# Altium project 324 Electrode Wafer.PrjPcb
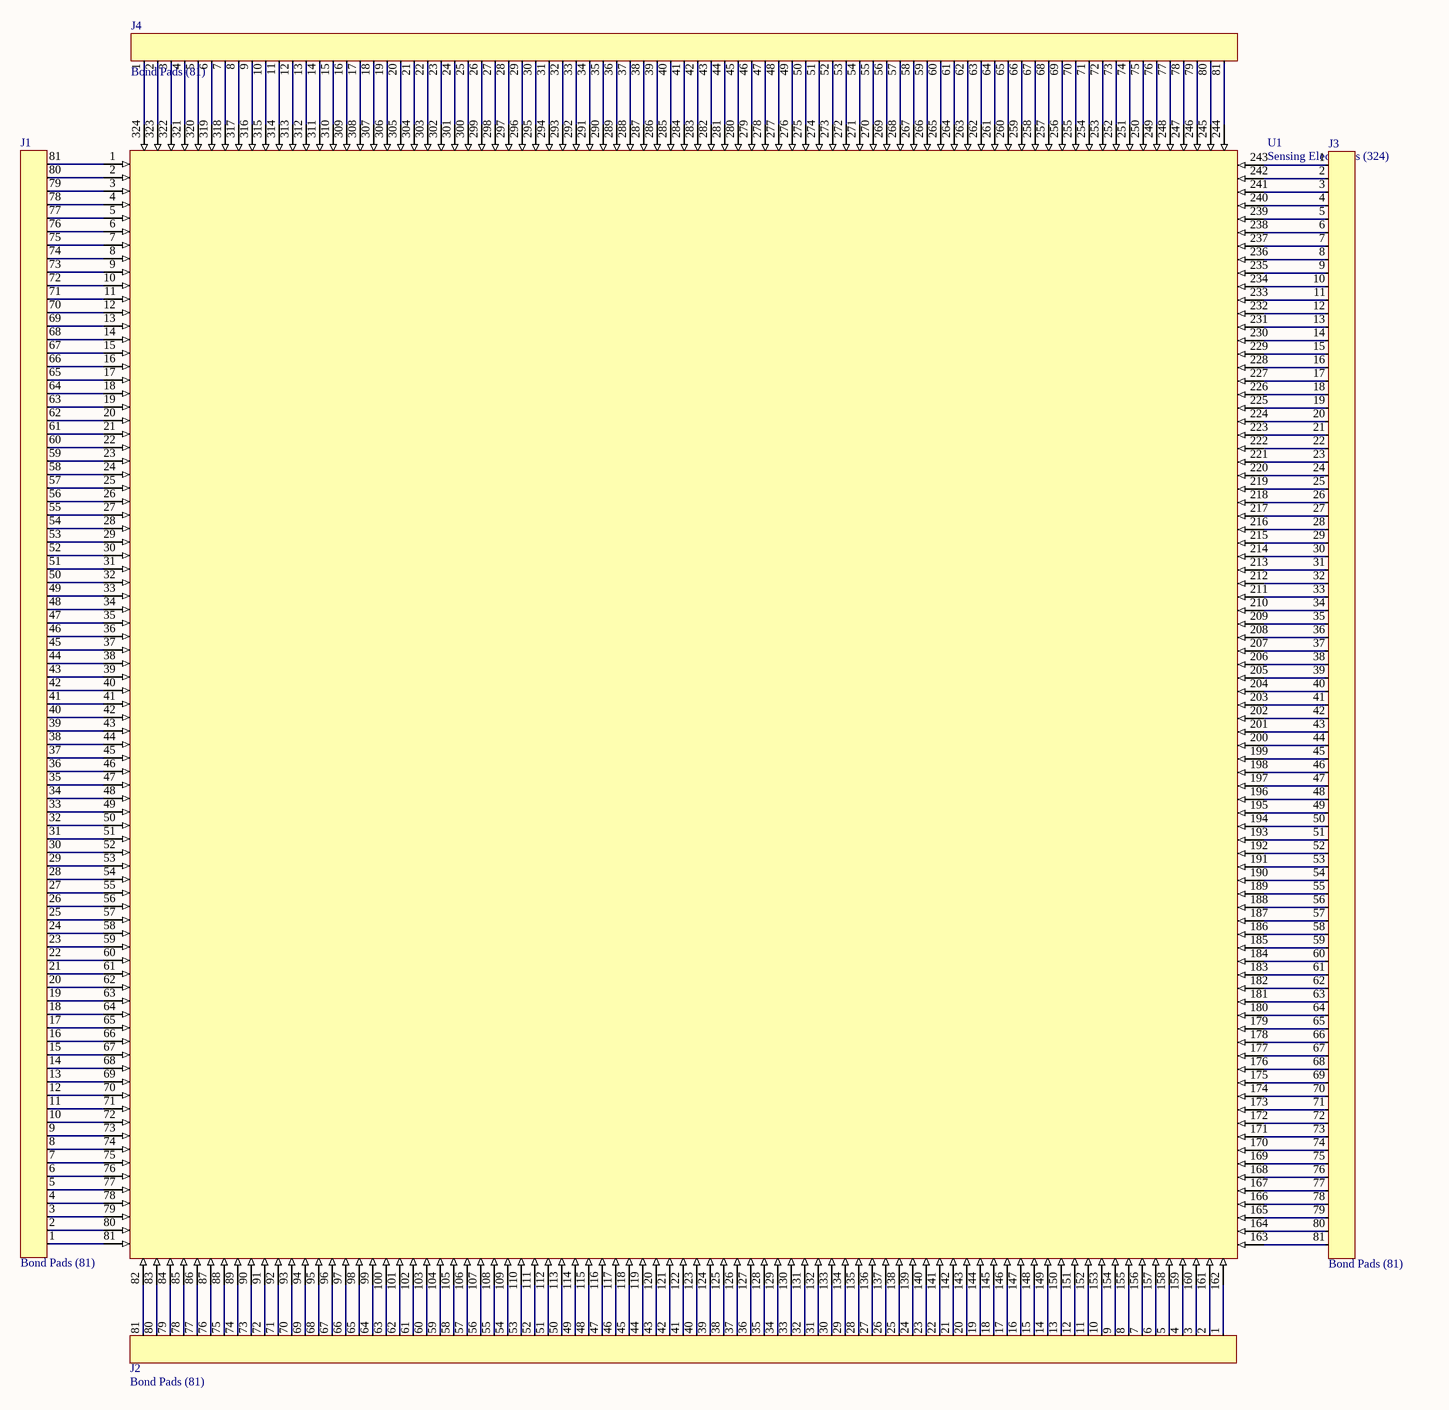
[diagram p0: 324 Electrode Wafer Schematic.SchDoc]
1 sheet, 5 parts. Net scope: global (net labels, ports and power ports of the same name join across sheets).
Board file: 324 Electrode Wafer PCB.PcbDoc

## Sheet 324 Electrode Wafer Schematic.SchDoc
size E; SheetNumber: 1; SheetTotal: 1

### Parts
J1  Bond Pads (81)  [Bond Pads (81)]
J2  Bond Pads (81)  [Bond Pads (81)]
J3  Bond Pads (81)  [Bond Pads (81)]
J4  Bond Pads (81)  [Bond Pads (81)]
U1  Sensing Electrodes (324)  [Sensing Area (324)]

### Nets
NetJ1_1: J1.1 U1.81
NetJ1_2: J1.2 U1.80
NetJ1_3: J1.3 U1.79
NetJ1_4: J1.4 U1.78
NetJ1_5: J1.5 U1.77
NetJ1_6: J1.6 U1.76
NetJ1_7: J1.7 U1.75
NetJ1_8: J1.8 U1.74
NetJ1_9: J1.9 U1.73
NetJ1_10: J1.10 U1.72
NetJ1_11: J1.11 U1.71
NetJ1_12: J1.12 U1.70
NetJ1_13: J1.13 U1.69
NetJ1_14: J1.14 U1.68
NetJ1_15: J1.15 U1.67
NetJ1_16: J1.16 U1.66
NetJ1_17: J1.17 U1.65
NetJ1_18: J1.18 U1.64
NetJ1_19: J1.19 U1.63
NetJ1_20: J1.20 U1.62
NetJ1_21: J1.21 U1.61
NetJ1_22: J1.22 U1.60
NetJ1_23: J1.23 U1.59
NetJ1_24: J1.24 U1.58
NetJ1_25: J1.25 U1.57
NetJ1_26: J1.26 U1.56
NetJ1_27: J1.27 U1.55
NetJ1_28: J1.28 U1.54
NetJ1_29: J1.29 U1.53
NetJ1_30: J1.30 U1.52
NetJ1_31: J1.31 U1.51
NetJ1_32: J1.32 U1.50
NetJ1_33: J1.33 U1.49
NetJ1_34: J1.34 U1.48
NetJ1_35: J1.35 U1.47
NetJ1_36: J1.36 U1.46
NetJ1_37: J1.37 U1.45
NetJ1_38: J1.38 U1.44
NetJ1_39: J1.39 U1.43
NetJ1_40: J1.40 U1.42
NetJ1_41: J1.41 U1.41
NetJ1_42: J1.42 U1.40
NetJ1_43: J1.43 U1.39
NetJ1_44: J1.44 U1.38
NetJ1_45: J1.45 U1.37
NetJ1_46: J1.46 U1.36
NetJ1_47: J1.47 U1.35
NetJ1_48: J1.48 U1.34
NetJ1_49: J1.49 U1.33
NetJ1_50: J1.50 U1.32
NetJ1_51: J1.51 U1.31
NetJ1_52: J1.52 U1.30
NetJ1_53: J1.53 U1.29
NetJ1_54: J1.54 U1.28
NetJ1_55: J1.55 U1.27
NetJ1_56: J1.56 U1.26
NetJ1_57: J1.57 U1.25
NetJ1_58: J1.58 U1.24
NetJ1_59: J1.59 U1.23
NetJ1_60: J1.60 U1.22
NetJ1_61: J1.61 U1.21
NetJ1_62: J1.62 U1.20
NetJ1_63: J1.63 U1.19
NetJ1_64: J1.64 U1.18
NetJ1_65: J1.65 U1.17
NetJ1_66: J1.66 U1.16
NetJ1_67: J1.67 U1.15
NetJ1_68: J1.68 U1.14
NetJ1_69: J1.69 U1.13
NetJ1_70: J1.70 U1.12
NetJ1_71: J1.71 U1.11
NetJ1_72: J1.72 U1.10
NetJ1_73: J1.73 U1.9
NetJ1_74: J1.74 U1.8
NetJ1_75: J1.75 U1.7
NetJ1_76: J1.76 U1.6
NetJ1_77: J1.77 U1.5
NetJ1_78: J1.78 U1.4
NetJ1_79: J1.79 U1.3
NetJ1_80: J1.80 U1.2
NetJ1_81: J1.81 U1.1
NetJ2_1: J2.1 U1.162
NetJ2_2: J2.2 U1.161
NetJ2_3: J2.3 U1.160
NetJ2_4: J2.4 U1.159
NetJ2_5: J2.5 U1.158
NetJ2_6: J2.6 U1.157
NetJ2_7: J2.7 U1.156
NetJ2_8: J2.8 U1.155
NetJ2_9: J2.9 U1.154
NetJ2_10: J2.10 U1.153
NetJ2_11: J2.11 U1.152
NetJ2_12: J2.12 U1.151
NetJ2_13: J2.13 U1.150
NetJ2_14: J2.14 U1.149
NetJ2_15: J2.15 U1.148
NetJ2_16: J2.16 U1.147
NetJ2_17: J2.17 U1.146
NetJ2_18: J2.18 U1.145
NetJ2_19: J2.19 U1.144
NetJ2_20: J2.20 U1.143
NetJ2_21: J2.21 U1.142
NetJ2_22: J2.22 U1.141
NetJ2_23: J2.23 U1.140
NetJ2_24: J2.24 U1.139
NetJ2_25: J2.25 U1.138
NetJ2_26: J2.26 U1.137
NetJ2_27: J2.27 U1.136
NetJ2_28: J2.28 U1.135
NetJ2_29: J2.29 U1.134
NetJ2_30: J2.30 U1.133
NetJ2_31: J2.31 U1.132
NetJ2_32: J2.32 U1.131
NetJ2_33: J2.33 U1.130
NetJ2_34: J2.34 U1.129
NetJ2_35: J2.35 U1.128
NetJ2_36: J2.36 U1.127
NetJ2_37: J2.37 U1.126
NetJ2_38: J2.38 U1.125
NetJ2_39: J2.39 U1.124
NetJ2_40: J2.40 U1.123
NetJ2_41: J2.41 U1.122
NetJ2_42: J2.42 U1.121
NetJ2_43: J2.43 U1.120
NetJ2_44: J2.44 U1.119
NetJ2_45: J2.45 U1.118
NetJ2_46: J2.46 U1.117
NetJ2_47: J2.47 U1.116
NetJ2_48: J2.48 U1.115
NetJ2_49: J2.49 U1.114
NetJ2_50: J2.50 U1.113
NetJ2_51: J2.51 U1.112
NetJ2_52: J2.52 U1.111
NetJ2_53: J2.53 U1.110
NetJ2_54: J2.54 U1.109
NetJ2_55: J2.55 U1.108
NetJ2_56: J2.56 U1.107
NetJ2_57: J2.57 U1.106
NetJ2_58: J2.58 U1.105
NetJ2_59: J2.59 U1.104
NetJ2_60: J2.60 U1.103
NetJ2_61: J2.61 U1.102
NetJ2_62: J2.62 U1.101
NetJ2_63: J2.63 U1.100
NetJ2_64: J2.64 U1.99
NetJ2_65: J2.65 U1.98
NetJ2_66: J2.66 U1.97
NetJ2_67: J2.67 U1.96
NetJ2_68: J2.68 U1.95
NetJ2_69: J2.69 U1.94
NetJ2_70: J2.70 U1.93
NetJ2_71: J2.71 U1.92
NetJ2_72: J2.72 U1.91
NetJ2_73: J2.73 U1.90
NetJ2_74: J2.74 U1.89
NetJ2_75: J2.75 U1.88
NetJ2_76: J2.76 U1.87
NetJ2_77: J2.77 U1.86
NetJ2_78: J2.78 U1.85
NetJ2_79: J2.79 U1.84
NetJ2_80: J2.80 U1.83
NetJ2_81: J2.81 U1.82
NetJ3_1: J3.1 U1.243
NetJ3_2: J3.2 U1.242
NetJ3_3: J3.3 U1.241
NetJ3_4: J3.4 U1.240
NetJ3_5: J3.5 U1.239
NetJ3_6: J3.6 U1.238
NetJ3_7: J3.7 U1.237
NetJ3_8: J3.8 U1.236
NetJ3_9: J3.9 U1.235
NetJ3_10: J3.10 U1.234
NetJ3_11: J3.11 U1.233
NetJ3_12: J3.12 U1.232
NetJ3_13: J3.13 U1.231
NetJ3_14: J3.14 U1.230
NetJ3_15: J3.15 U1.229
NetJ3_16: J3.16 U1.228
NetJ3_17: J3.17 U1.227
NetJ3_18: J3.18 U1.226
NetJ3_19: J3.19 U1.225
NetJ3_20: J3.20 U1.224
NetJ3_21: J3.21 U1.223
NetJ3_22: J3.22 U1.222
NetJ3_23: J3.23 U1.221
NetJ3_24: J3.24 U1.220
NetJ3_25: J3.25 U1.219
NetJ3_26: J3.26 U1.218
NetJ3_27: J3.27 U1.217
NetJ3_28: J3.28 U1.216
NetJ3_29: J3.29 U1.215
NetJ3_30: J3.30 U1.214
NetJ3_31: J3.31 U1.213
NetJ3_32: J3.32 U1.212
NetJ3_33: J3.33 U1.211
NetJ3_34: J3.34 U1.210
NetJ3_35: J3.35 U1.209
NetJ3_36: J3.36 U1.208
NetJ3_37: J3.37 U1.207
NetJ3_38: J3.38 U1.206
NetJ3_39: J3.39 U1.205
NetJ3_40: J3.40 U1.204
NetJ3_41: J3.41 U1.203
NetJ3_42: J3.42 U1.202
NetJ3_43: J3.43 U1.201
NetJ3_44: J3.44 U1.200
NetJ3_45: J3.45 U1.199
NetJ3_46: J3.46 U1.198
NetJ3_47: J3.47 U1.197
NetJ3_48: J3.48 U1.196
NetJ3_49: J3.49 U1.195
NetJ3_50: J3.50 U1.194
NetJ3_51: J3.51 U1.193
NetJ3_52: J3.52 U1.192
NetJ3_53: J3.53 U1.191
NetJ3_54: J3.54 U1.190
NetJ3_55: J3.55 U1.189
NetJ3_56: J3.56 U1.188
NetJ3_57: J3.57 U1.187
NetJ3_58: J3.58 U1.186
NetJ3_59: J3.59 U1.185
NetJ3_60: J3.60 U1.184
NetJ3_61: J3.61 U1.183
NetJ3_62: J3.62 U1.182
NetJ3_63: J3.63 U1.181
NetJ3_64: J3.64 U1.180
NetJ3_65: J3.65 U1.179
NetJ3_66: J3.66 U1.178
NetJ3_67: J3.67 U1.177
NetJ3_68: J3.68 U1.176
NetJ3_69: J3.69 U1.175
NetJ3_70: J3.70 U1.174
NetJ3_71: J3.71 U1.173
NetJ3_72: J3.72 U1.172
NetJ3_73: J3.73 U1.171
NetJ3_74: J3.74 U1.170
NetJ3_75: J3.75 U1.169
NetJ3_76: J3.76 U1.168
NetJ3_77: J3.77 U1.167
NetJ3_78: J3.78 U1.166
NetJ3_79: J3.79 U1.165
NetJ3_80: J3.80 U1.164
NetJ3_81: J3.81 U1.163
NetJ4_1: J4.1 U1.324
NetJ4_2: J4.2 U1.323
NetJ4_3: J4.3 U1.322
NetJ4_4: J4.4 U1.321
NetJ4_5: J4.5 U1.320
NetJ4_6: J4.6 U1.319
NetJ4_7: J4.7 U1.318
NetJ4_8: J4.8 U1.317
NetJ4_9: J4.9 U1.316
NetJ4_10: J4.10 U1.315
NetJ4_11: J4.11 U1.314
NetJ4_12: J4.12 U1.313
NetJ4_13: J4.13 U1.312
NetJ4_14: J4.14 U1.311
NetJ4_15: J4.15 U1.310
NetJ4_16: J4.16 U1.309
NetJ4_17: J4.17 U1.308
NetJ4_18: J4.18 U1.307
NetJ4_19: J4.19 U1.306
NetJ4_20: J4.20 U1.305
NetJ4_21: J4.21 U1.304
NetJ4_22: J4.22 U1.303
NetJ4_23: J4.23 U1.302
NetJ4_24: J4.24 U1.301
NetJ4_25: J4.25 U1.300
NetJ4_26: J4.26 U1.299
NetJ4_27: J4.27 U1.298
NetJ4_28: J4.28 U1.297
NetJ4_29: J4.29 U1.296
NetJ4_30: J4.30 U1.295
NetJ4_31: J4.31 U1.294
NetJ4_32: J4.32 U1.293
NetJ4_33: J4.33 U1.292
NetJ4_34: J4.34 U1.291
NetJ4_35: J4.35 U1.290
NetJ4_36: J4.36 U1.289
NetJ4_37: J4.37 U1.288
NetJ4_38: J4.38 U1.287
NetJ4_39: J4.39 U1.286
NetJ4_40: J4.40 U1.285
NetJ4_41: J4.41 U1.284
NetJ4_42: J4.42 U1.283
NetJ4_43: J4.43 U1.282
NetJ4_44: J4.44 U1.281
NetJ4_45: J4.45 U1.280
NetJ4_46: J4.46 U1.279
NetJ4_47: J4.47 U1.278
NetJ4_48: J4.48 U1.277
NetJ4_49: J4.49 U1.276
NetJ4_50: J4.50 U1.275
NetJ4_51: J4.51 U1.274
NetJ4_52: J4.52 U1.273
NetJ4_53: J4.53 U1.272
NetJ4_54: J4.54 U1.271
NetJ4_55: J4.55 U1.270
NetJ4_56: J4.56 U1.269
NetJ4_57: J4.57 U1.268
NetJ4_58: J4.58 U1.267
NetJ4_59: J4.59 U1.266
NetJ4_60: J4.60 U1.265
NetJ4_61: J4.61 U1.264
NetJ4_62: J4.62 U1.263
NetJ4_63: J4.63 U1.262
NetJ4_64: J4.64 U1.261
NetJ4_65: J4.65 U1.260
NetJ4_66: J4.66 U1.259
NetJ4_67: J4.67 U1.258
NetJ4_68: J4.68 U1.257
NetJ4_69: J4.69 U1.256
NetJ4_70: J4.70 U1.255
NetJ4_71: J4.71 U1.254
NetJ4_72: J4.72 U1.253
NetJ4_73: J4.73 U1.252
NetJ4_74: J4.74 U1.251
NetJ4_75: J4.75 U1.250
NetJ4_76: J4.76 U1.249
NetJ4_77: J4.77 U1.248
NetJ4_78: J4.78 U1.247
NetJ4_79: J4.79 U1.246
NetJ4_80: J4.80 U1.245
NetJ4_81: J4.81 U1.244

### Library data of the parts
J1-J4 = Bond Pads (81): 81 pads for all four sides of the chip; Part Number: Bond Pads (81)
U1 = Silicon Die Holder 324 Electrodes: 324 Electrodes covering a 2mm by 2mm sensing 10x; Part Number: Silicon Die Holder 324 Electrodes